# EAGLE design Bottlesumo-v2 (EAGLE 9.7.0)
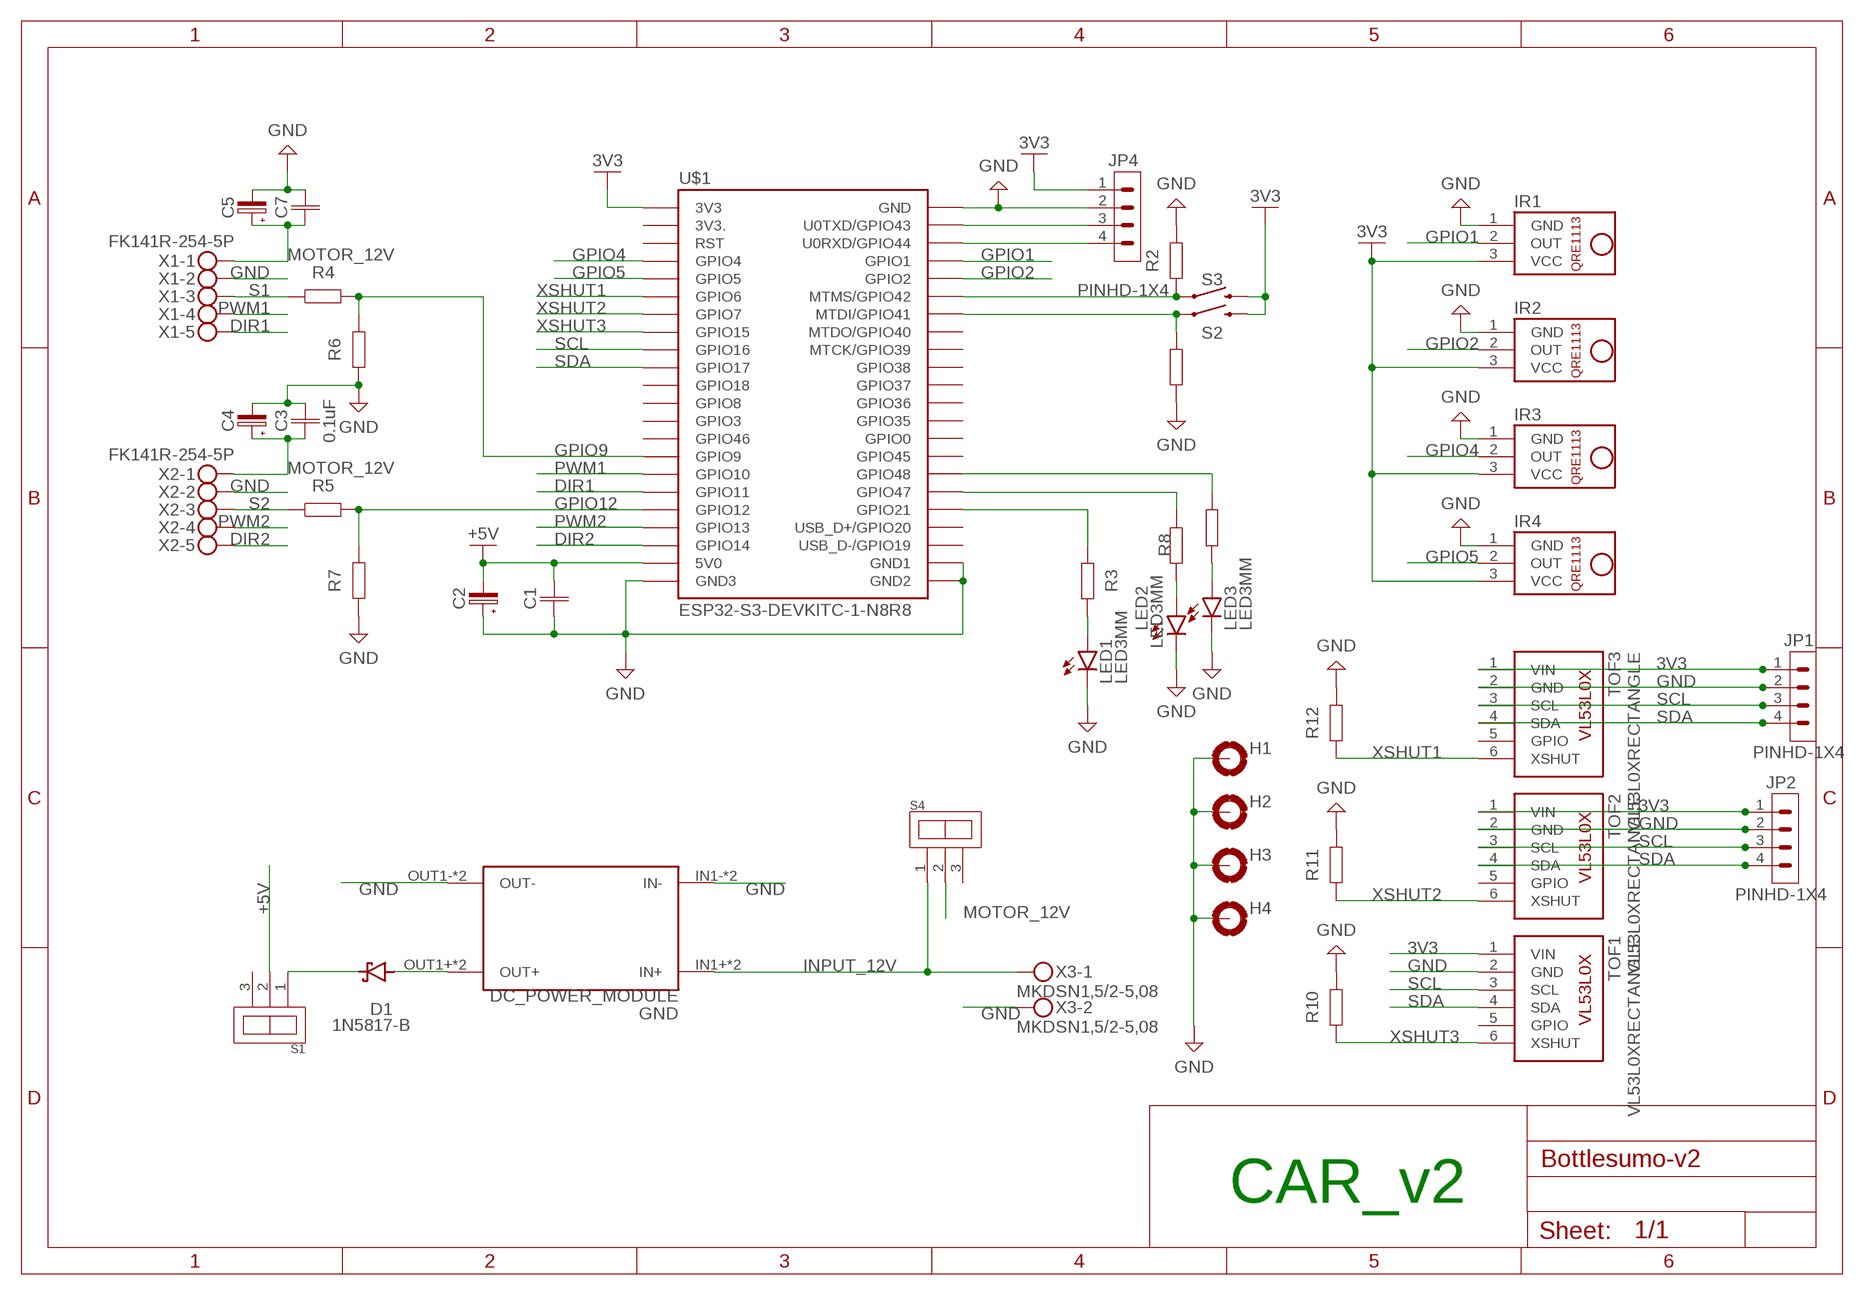
[diagram p0: schematic, sheet 1]

## Parts
C1  C_CHIP-1206(3216-METRIC)  [CAPC3216X135]
C2  C-POL_TANTALUM-1206(3216-METRIC)  [CAPMP3216X180N]
C3  0.1uF  C_CHIP-1206(3216-METRIC)  [CAPC3216X135]
C4  C-POL_TANTALUM-1206(3216-METRIC)  [CAPMP3216X180N]
C5  C-POL_TANTALUM-1206(3216-METRIC)  [CAPMP3216X180N]
C7  C_CHIP-1206(3216-METRIC)  [CAPC3216X135]
D1  1N5817-B  [DO41-7.6]
GND  DC_POWER_MODULE  [DC_POWER_MODULE]
H1  MOUNT-PAD-ROUND3.2  [3,2-PAD]
H2  MOUNT-PAD-ROUND3.2  [3,2-PAD]
H3  MOUNT-PAD-ROUND3.2  [3,2-PAD]
H4  MOUNT-PAD-ROUND3.2  [3,2-PAD]
IR1  QRE1113  [QRE1113]
IR2  QRE1113  [QRE1113]
IR3  QRE1113  [QRE1113]
IR4  QRE1113  [QRE1113]
JP1  PINHD-1X4  [1X04]
JP2  PINHD-1X4  [1X04]
JP4  PINHD-1X4  [1X04]
LED1  LED3MM  [LED3MM]
LED2  LED3MM  [LED3MM]
LED3  LED3MM  [LED3MM]
R1  R_CHIP-1206(3216-METRIC)  [RESC3216X70]
R2  R_CHIP-1206(3216-METRIC)  [RESC3216X70]
R3  R_CHIP-1206(3216-METRIC)  [RESC3216X70]
R4  R_CHIP-1206(3216-METRIC)  [RESC3216X70]
R5  R_CHIP-1206(3216-METRIC)  [RESC3216X70]
R6  R_CHIP-1206(3216-METRIC)  [RESC3216X70]
R7  R_CHIP-1206(3216-METRIC)  [RESC3216X70]
R8  R_CHIP-1206(3216-METRIC)  [RESC3216X70]
R9  R_CHIP-1206(3216-METRIC)  [RESC3216X70]
R10  R_CHIP-1206(3216-METRIC)  [RESC3216X70]
R11  R_CHIP-1206(3216-METRIC)  [RESC3216X70]
R12  R_CHIP-1206(3216-METRIC)  [RESC3216X70]
S1  SS12D10  SS12D10SS12D10_SS12D10  [SS12D10]
S2  MOMENTARY-SWITCH-SPST-PTH-12MM  [TACTILE_SWITCH_PTH_12MM]
S3  MOMENTARY-SWITCH-SPST-PTH-12MM  [TACTILE_SWITCH_PTH_12MM]
S4  SS12D10  SS12D10SS12D10_SS12D10  [SS12D10]
TOF1  VL53L0XRECTANGLE  [VL53L0X]
TOF2  VL53L0XRECTANGLE  [VL53L0X]
TOF3  VL53L0XRECTANGLE  [VL53L0X]
U$1  ESP32-S3-DEVKITC-1-N8R8  [ESP32-S3-DEVKITC-1-N8R8]
X1  FK141R-254-5P  [KF141R-254-5P]
X2  FK141R-254-5P  [KF141R-254-5P]
X3  MKDSN1,5/2-5,08  [MKDSN1,5/2-5,08]

## Nets
3V3: IR1.3(VCC) IR2.3(VCC) IR3.3(VCC) IR4.3(VCC) JP1.1 JP2.1 JP4.1 S2.3 S2.4 S3.3 S3.4 TOF1.1(VIN) TOF2.1(VIN) TOF3.1(VIN) U$1.J1_1(3V3)
+5V: C1.2 C2.2(-) S1.2(NULL) U$1.J1_21(5V0)
DIR1: U$1.J1_17(GPIO11) X1.P$9 X1.P$10
DIR2: U$1.J1_20(GPIO14) X2.P$9 X2.P$10
GND: C1.1 C2.1(+) C3.2 C4.2(-) C5.2(-) C7.2 GND.IN1-(IN-) GND.IN2-(IN-) GND.OUT1-(OUT-) GND.OUT2-(OUT-) H1.B3,2(MOUNT) H2.B3,2(MOUNT) H3.B3,2(MOUNT) H4.B3,2(MOUNT) IR1.1(GND) IR2.1(GND) IR3.1(GND) IR4.1(GND) JP1.2 JP2.2 JP4.2 LED1.K(C) LED2.K(C) LED3.K(C) R1.1 R2.2 R6.1 R7.1 R10.2 R11.2 R12.2 TOF1.2(GND) TOF2.2(GND) TOF3.2(GND) U$1.J1_22(GND3) U$1.J3_1(GND) U$1.J3_21(GND1) U$1.J3_22(GND2) X1.P$2 X1.P$6 X2.P$2 X2.P$6 X3.2
GPIO1: IR1.2(OUT) U$1.J3_4(GPIO1)
GPIO2: IR2.2(OUT) U$1.J3_5(GPIO2)
GPIO4: IR3.2(OUT) U$1.J1_4(GPIO4)
GPIO5: IR4.2(OUT) U$1.J1_5(GPIO5)
GPIO9: R4.2 R6.2 U$1.J1_15(GPIO9)
GPIO12: R5.2 R7.2 U$1.J1_18(GPIO12)
INPUT_12V: GND.IN1+(IN+) GND.IN2+(IN+) S4.1(NULL) X3.1
MOTOR_12V: C3.1 C4.1(+) C5.1(+) C7.1 S4.2(NULL) X1.P$1 X1.P$5 X2.P$1 X2.P$5
N$1: D1.A GND.OUT1+(OUT+) GND.OUT2+(OUT+)
N$2: D1.C S1.1(NULL)
N$3: R1.2 S2.1 S2.2 U$1.J3_7(MTDI/GPIO41)
N$4: R2.1 S3.1 S3.2 U$1.J3_6(MTMS/GPIO42)
N$5: R3.1 U$1.J3_18(GPIO21)
N$6: LED1.A R3.2
N$7: R8.1 U$1.J3_17(GPIO47)
N$8: LED2.A R8.2
N$9: R9.1 U$1.J3_16(GPIO48)
N$10: LED3.A R9.2
N$11: U$1.J3_19(USB_D+/GPIO20)
N$12: JP4.3 U$1.J3_2(U0TXD/GPIO43)
N$13: JP4.4 U$1.J3_3(U0RXD/GPIO44)
PWM1: U$1.J1_16(GPIO10) X1.P$4 X1.P$8
PWM2: U$1.J1_19(GPIO13) X2.P$4 X2.P$8
S1: R4.1 X1.P$3 X1.P$7
S2: R5.1 X2.P$3 X2.P$7
SCL: JP1.3 JP2.3 TOF1.3(SCL) TOF2.3(SCL) TOF3.3(SCL) U$1.J1_9(GPIO16)
SDA: JP1.4 JP2.4 TOF1.4(SDA) TOF2.4(SDA) TOF3.4(SDA) U$1.J1_10(GPIO17)
XSHUT1: R12.1 TOF3.6(XSHUT) U$1.J1_6(GPIO6)
XSHUT2: R11.1 TOF2.6(XSHUT) U$1.J1_7(GPIO7)
XSHUT3: R10.1 TOF1.6(XSHUT) U$1.J1_8(GPIO15)
Unconnected: S1.3(NULL) S4.3(NULL) TOF1.5(GPIO) TOF2.5(GPIO) TOF3.5(GPIO) U$1.J1_3(RST) U$1.J1_11(GPIO18) U$1.J1_12(GPIO8) U$1.J1_13(GPIO3) U$1.J1_14(GPIO46) U$1.J3_8(MTDO/GPIO40) U$1.J3_9(MTCK/GPIO39) U$1.J3_10(GPIO38) U$1.J3_11(GPIO37) U$1.J3_12(GPIO36) U$1.J3_13(GPIO35) U$1.J3_14(GPIO0) U$1.J3_15(GPIO45) U$1.J3_20(USB_D-/GPIO19)

## Notes on the sheet
- CAR_v2

## Power pins joined to a net without a drawn wire
3V3.: U$1.J1_2(3V3.)

## Library data of the parts
C1 C3 C7 = PAEN Components Library:C: Capacitor - Generic
C2 C4 C5 = PAEN Components Library:C-POL: Capacitor Polarised - Generic
D1 = PAEN Components Library:1N581*: 1.0A SCHOTTKY BARRIER RECTIFIER Source: http://www.diodes.com/datasheets/ds23001.pdf
GND = PAEN Components Library:DC_POWER_MODULE
H1-H4 = PAEN Components Library:MOUNT-PAD-ROUND: MOUNTING PAD, round
IR1-IR4 = PAEN Components Library:QRE1113
JP1 JP2 JP4 = PAEN Components Library:PINHD-1X4: Pin Header
LED1-LED3 = PAEN Components Library:LED
R1-R12 = PAEN Components Library:R: Resistor Fixed - Generic
S1 S4 = PAEN Components Library:SS12D10: Vertical Slide Switch 3 Pins 6.7x12.7x6.4mm.
S2 S3 = PAEN Components Library:MOMENTARY-SWITCH-SPST: Momentary Switch (Pushbutton) - SPST Normally-open (NO) SPST momentary switches (buttons, pushbuttons). Variants PTH-12MM - 12mm square, through-hole Momentary Pushbutton Switch - 12mm Square <https://www.sparkfun.com/products/9190> (COM-09190) PTH-6.0MM, PTH-6.0MM-KIT - 6.0mm square, through-hole Mini Pushbutton Switch <https://www.sparkfun.com/products/97> (COM-00097) KIT package intended for soldering kit's - only one side of pads' copper is exposed. PTH-RIGHT-ANGLE-KIT - Right-angle, through-hole Right Angle Tactile Button <https://www.sparkfun.com/products/10791> - Used on SparkFun BigTime Watch Kit <https://www.sparkfun.com/products/11734> SMD-12MM - 12mm square, surface-mount Tactile Button - SMD (12mm) <https://www.sparkfun.com/products/12993> (COM-12993) Used on SparkFun PicoBoard <https://www.sparkfun.com/products/11888> SMD-4.5MM - 4.5mm Square Trackball Switch Used on SparkFun Blackberry Trackballer Breakout <https://www.sparkfun.com/products/13169> SMD-4.6MMX2.8MM - 4.60mm x 2.80mm, surface mount Used on SparkFun SAMD21 Mini Breakout <https://www.sparkfun.com/products/13664> SMD-5.2MM, SMD-5.2-REDUNDANT - 5.2mm square, surface-mount Mini Pushbutton Switch - SMD <https://www.sparkfun.com/products/8720> (COM-08720) Used on Arduino Pro Mini <https://www.sparkfun.com/products/11114> REDUNDANT package connects both switch circuits together SMD-6.0X3.5MM - 6.0 x 3.5mm, surface mount Momentary Reset Switch SMD <https://www.sparkfun.com/products/8229> (COM-08229) SMD-6.2MM-TALL - 6.2mm square, surface mount Tactile Button - SMD (6mm) <https://www.sparkfun.com/products/12992> Used on SparkFun Digital Sandbox <https://www.sparkfun.com/products/12651> SMD-RIGHT-ANGLE - Right-angle, surface mount Used on SparkFun Block for Intel® Edison - Arduino <https://www.sparkfun.com/products/13036>
TOF1-TOF3 = PAEN Components Library:VL53L0X
U$1 = PAEN Components Library:ESP32-S3-DEVKITC-1-N8R8: Check availability <https://pricing.snapeda.com/parts/ESP32-S3-DEVKITC-1-N8R8/Espressif%20Systems/view-part?ref=eda>
X1 X2 = PAEN Components Library:FK141R-254-5P
X3 = PAEN Components Library:MKDSN1,5/2-5,08: MKDSN 1,5/ 2-5,08 Printklemme Nennstrom: 13,5 A Nennspannung: 250 V Rastermaß: 5,08 mm Polzahl: 2 Anschlussart: Schraubanschluss Montage: Löten Anschlussrichtung Leiter/Platine: 0 ° Artikelnummer: 1729128 Source: http://eshop.phoenixcontact.com .. 1729128.pdf

## Board
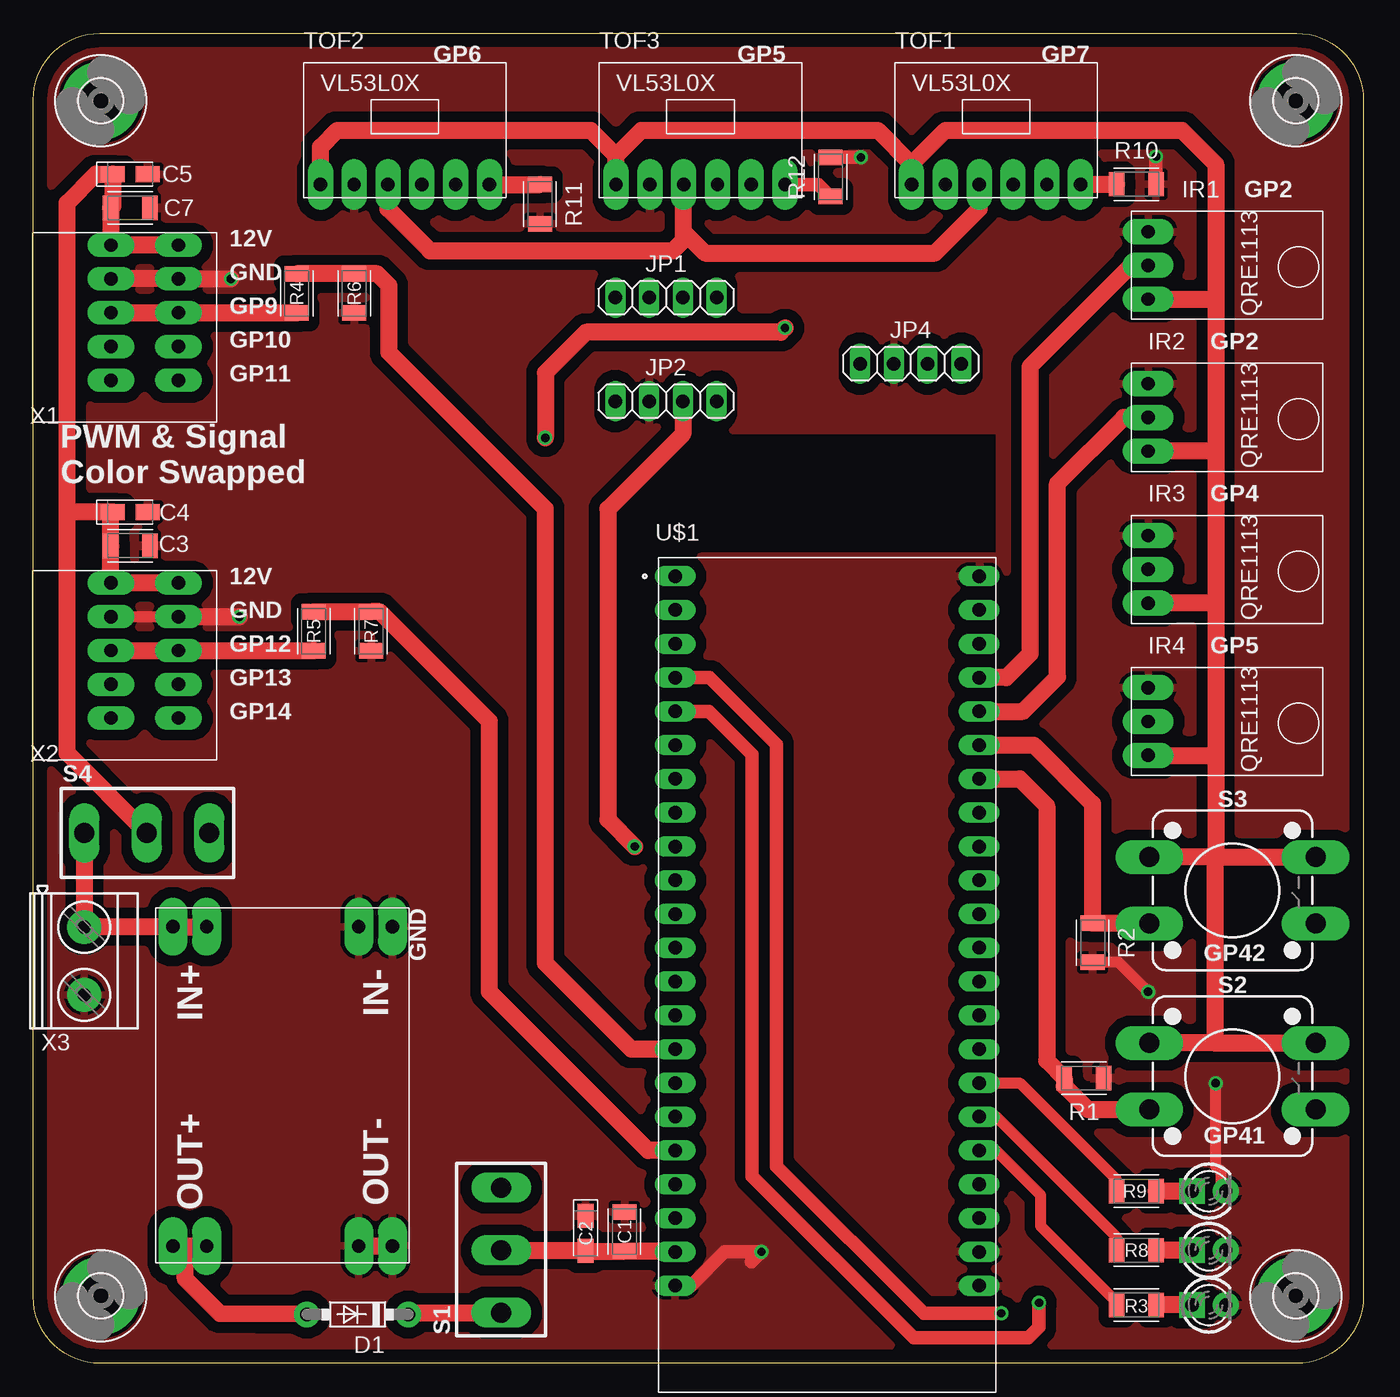
[diagram p1: board, top side]
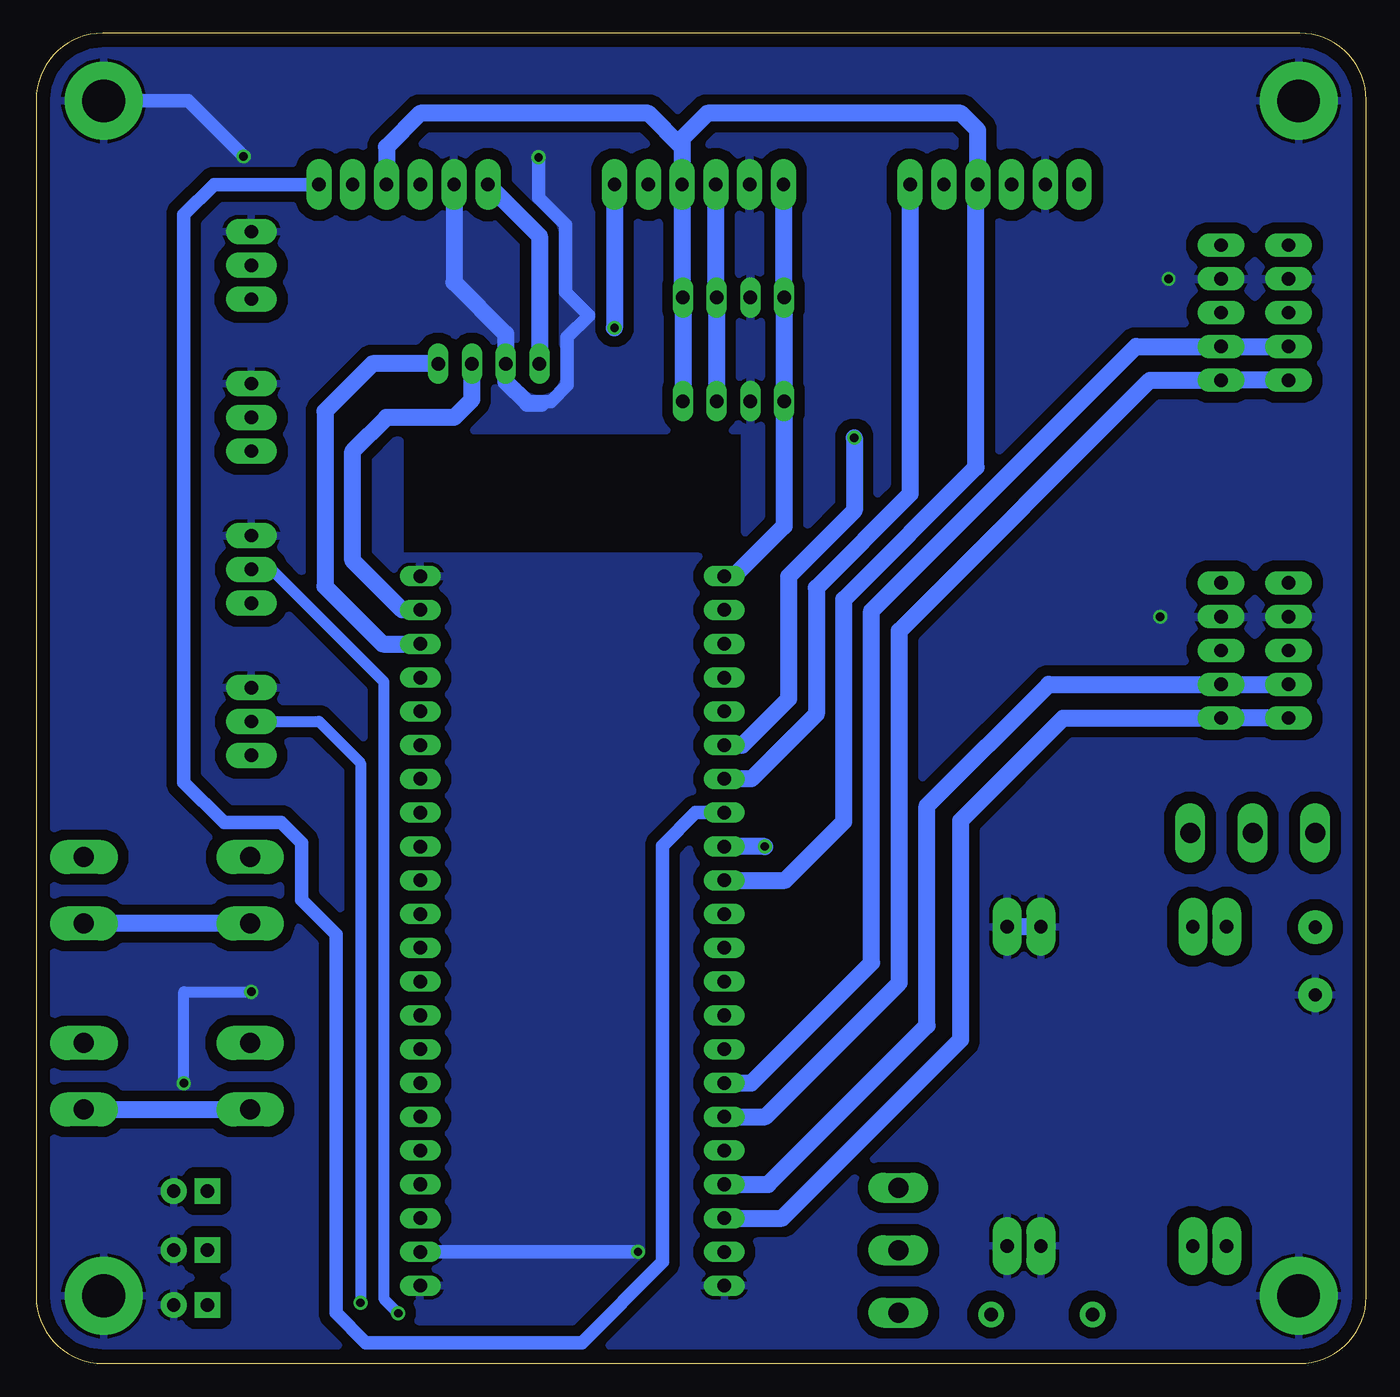
[diagram p2: board, bottom side, seen from below]

Size 100 x 100 mm. Coordinates in mm from the lower left corner, seen from the top.
Outline: 0,5 0,95 arc-90 5,100 95,100 arc-90 100,95 100,5 arc-90 95,0 5,0 arc-90 0,5
Copper layers (1*16): Top / Bottom
Stack-up Default Layer Stack: Top SilkScreen Epoxy Ink / Top SolderMask SR:Green 0.0254mm Dk 4.3 / Top Surface Finish Lead-Free 0.02mm / Top CuFoil:007 0.035mm / Dielectric-1 User Defined 1.5mm / Bottom CuFoil:007 0.035mm / Bottom Surface Finish Lead-Free 0.02mm / Bottom SolderMask SR:Green 0.0254mm Dk 4.3 / Bottom SilkScreen Epoxy Ink
Design rules: minimum drill size 25mil, minimum copper width 16mil, keepout clearance 0mil, drill distance 32mil, via restrict clearance 0mil, dimension clearance 40mil, restrict clearance 0mil, copper clearance wire_polygon to wire_polygon 16mil, copper clearance wire_polygon to pad_smd 16mil, copper clearance wire_polygon to via 16mil, copper clearance pad_smd to pad_smd 16mil, copper clearance pad_smd to via 16mil, copper clearance via to via 16mil, copper clearance smd to pad (same net) 16mil, copper clearance smd to via (same net) 16mil, copper clearance smd to smd (same net) 16mil

### Footprints (pad centres in the part's own frame; a part is rotated, then mirrored left to right if it is on the bottom)
CAPC3216X135 = smd 1.165 x 1.815: 1 -1.475,0; 2 1.475,0
CAPMP3216X180N = smd 1.796 x 1.189: 1 -1.31,0; 2 1.31,0
DO41-7.6 = drill 1 pad 1.93: A 3.81,0; C -3.81,0
DC_POWER_MODULE = drill 1 pad 2.184 long: IN1+ -24,-13.97; IN1- -24,0; IN2+ -24,-16.51; IN2- -24,-2.54; OUT1+ 0,-13.97; OUT1- 0,0; OUT2+ 0,-16.51; OUT2- 0,-2.54
3,2-PAD = drill 3.2 pad 5.842: B3,2 0,0
QRE1113 = drill 1 pad 1.93 long: 1 0,2.54; 2 0,0; 3 0,-2.54
1X04 = drill 1.016 long: 1 -3.81,0; 2 -1.27,0; 3 1.27,0; 4 3.81,0
LED3MM = drill 1 pad 1.93 square: A -1.27,0 | drill 1 pad 1.93: K 1.27,0
RESC3216X70 = smd 1.165 x 1.815: 1 -1.475,0; 2 1.475,0
SS12D10 = drill 1.5 pad 2 long: 1 -4.7,0; 2 0,0; 3 4.7,0
TACTILE_SWITCH_PTH_12MM = drill 1.5 pad 2.54 long: 1 6.25,-2.5; 2 -6.25,-2.5; 3 6.25,2.5; 4 -6.25,2.5
VL53L0X = drill 1 pad 1.93 long: 1 -6.35,-0.267; 2 -3.81,-0.267; 3 -1.27,-0.267; 4 1.27,-0.267; 5 3.81,-0.267; 6 6.35,-0.267
ESP32-S3-DEVKITC-1-N8R8 = drill 1.02 long: J1_1 -11.43,29.97; J1_2 -11.43,27.43; J1_3 -11.43,24.89; J1_4 -11.43,22.35; J1_5 -11.43,19.81; J1_6 -11.43,17.27; J1_7 -11.43,14.73; J1_8 -11.43,12.19; J1_9 -11.43,9.65; J1_10 -11.43,7.11; J1_11 -11.43,4.57; J1_12 -11.43,2.03; J1_13 -11.43,-0.51; J1_14 -11.43,-3.05; J1_15 -11.43,-5.59; J1_16 -11.43,-8.13; J1_17 -11.43,-10.67; J1_18 -11.43,-13.21; J1_19 -11.43,-15.75; J1_20 -11.43,-18.29; J1_21 -11.43,-20.83; J1_22 -11.43,-23.37; J3_1 11.43,29.97; J3_2 11.43,27.43; J3_3 11.43,24.89; J3_4 11.43,22.35; J3_5 11.43,19.81; J3_6 11.43,17.27; J3_7 11.43,14.73; J3_8 11.43,12.19; J3_9 11.43,9.65; J3_10 11.43,7.11; J3_11 11.43,4.57; J3_12 11.43,2.03; J3_13 11.43,-0.51; J3_14 11.43,-3.05; J3_15 11.43,-5.59; J3_16 11.43,-8.13; J3_17 11.43,-10.67; J3_18 11.43,-13.21; J3_19 11.43,-15.75; J3_20 11.43,-18.29; J3_21 11.43,-20.83; J3_22 11.43,-23.37
KF141R-254-5P = drill 1 pad 1.778 long: P$1 0,0; P$2 2.54,0; P$3 5.08,0; P$4 7.62,0; P$5 0,-5.08; P$6 2.54,-5.08; P$7 5.08,-5.08; P$8 7.62,-5.08; P$9 10.16,0; P$10 10.16,-5.08
MKDSN1,5/2-5,08 = drill 1 pad 2.54: 1 -2.561,0.025; 2 2.519,0.025

### Placement (x,y rotation side)
C1  44.45,9.91 270 top
C2  41.53,9.78 270 top
C3  7.29,61.47 0 top
C4  7.29,64.01 0 top
C5  7.29,89.41 0 top
C7  7.29,86.87 0 top
D1  24.38,3.68 180 top
GND  27,8.83 270 top
H1  94.92,5.08 0 top
H2  5.08,5.08 0 top
H3  94.92,94.92 0 top
H4  5.08,94.92 0 top
IR1  83.82,82.55 0 top
IR2  83.82,71.12 0 top
IR3  83.82,59.69 0 top
IR4  83.82,48.26 0 top
JP1  47.57,80.13 0 top
JP2  47.57,72.34 0 top
JP4  65.96,75.15 0 top
LED1  88.39,4.39 0 top
LED2  88.39,8.51 0 top
LED3  88.39,12.95 0 top
R1  78.99,21.45 180 top
R2  79.65,31.62 270 top
R3  82.93,4.39 0 top
R4  19.81,80.44 90 top
R5  21.08,55.04 90 top
R6  24.13,80.44 90 top
R7  25.4,55.04 90 top
R8  82.93,8.51 0 top
R9  82.93,12.95 0 top
R10  82.93,88.65 0 top
R11  38.1,87.15 270 top
R12  59.94,89.2 90 top
S1  35.18,8.51 90 top
S2  90.16,21.59 0 top
S3  90.16,35.56 0 top
S4  8.54,39.88 0 top
TOF1  72.39,88.9 0 top
TOF2  27.94,88.9 0 top
TOF3  50.17,88.9 0 top
U$1  59.69,29.21 0 top
X1  10.92,84.07 270 top
X2  10.92,58.67 270 top
X3  3.81,30.23 270 top

### Tracks (layer width: path | path; a pad name or v marks a point on that pad's centre or on a via)
3V3
  Top 1.27: TOF2.1 21.59,91.44 22.86,92.71 41.91,92.71 43.81,90.8 | TOF3.1 43.81,90.8 | 43.81,90.8 45.72,92.71 63.5,92.71 66.04,90.17 | 66.04,90.17 TOF1.1 | 66.04,90.17 68.58,92.71 86.36,92.71 88.9,90.17 88.9,80.01 | 88.9,80.01 88.9,68.58 | 88.9,68.58 88.9,57.15 | 88.9,57.15 88.9,45.72 | 88.9,45.72 88.9,38.1 88.86,38.06 | 88.86,24.09 88.86,38.06 | IR1.3 88.9,80.01 | 88.9,68.58 IR2.3 | 88.9,57.15 IR3.3 | IR4.3 88.9,45.72 | 88.86,24.09 S2.3 | 88.86,24.09 S2.4 | 88.86,38.06 S3.3 | 88.86,38.06 S3.4
  Bottom 1.27: TOF1.1 62.15,84.75 JP4.1 | TOF3.1 43.81,80.18 JP1.1 JP2.1 43.76,62.94 43.76,62.93 47.52,59.18 U$1.J1_1
+5V
  Top 1.27: S1.2 41.49,8.51 C2.2 41.57,8.43 C1.2 48.21,8.43 U$1.J1_21
DIR1
  Bottom 1.27: U$1.J1_17 45.18,18.54 35.1,28.62 35.1,55.07 16.26,73.91 X1.P$9 X1.P$10
DIR2
  Bottom 1.27: U$1.J1_20 43.91,10.92 30.48,24.35 30.48,40.81 22.78,48.51 X2.P$9 X2.P$10
GND  (via drill 0.64)
  Top 0.813: X2.P$6 X2.P$2 | LED3.K 89.31,13.31 89.31,14.42 88.9,14.83 v88.9,21.06 | R2.2 81.61,30.15 v83.82,27.94
  Top 1.016: R12.2 v62.23,90.68 | R10.2 v84.41,90.74 | 53.98,7.62 v54.75,8.39 51.98,8.39 49.44,5.84 U$1.J1_22
  Top 1.27: GND.OUT2- GND.OUT1- | X1.P$6 X1.P$2 v14.86,81.53 | X2.P$2 v15.49,56.13
  Bottom 0.813: v88.9,21.06 88.9,27.94 v83.82,27.94
  Bottom 1.016: JP4.2 64.69,73.99 63.02,72.31 61.29,72.31 60.07,73.53 60.07,77.14 58.47,78.74 58.47,78.79 60.2,80.52 60.2,85.6 62.23,87.63 v62.23,90.68 | v84.41,90.74 88.59,94.92 H3.B3,2 | U$1.J3_21 v54.76,8.38 v54.75,8.39
  Bottom 1.27: 46.3,88.58 TOF3.2 | GND.IN2- GND.IN1- | TOF1.2 68.58,81.28 64.69,77.39 JP4.2 64.69,73.81 63.07,72.18 62.02,72.18
  pour Top (isolate 0.152): 100.33,100.33 -2.54,100.33 -2.54,0 100.33,0
  pour Bottom (isolate 0.152): -1.27,0 -1.27,99.06 100.33,99.06 100.33,0
GPIO1
  Top 1.27: U$1.J3_4 73.15,51.56 74.93,53.34 74.93,74.93 82.55,82.55 IR1.2
GPIO2
  Top 1.27: U$1.J3_5 74.42,49.02 77.01,51.61 77.01,66.15 81.98,71.12 IR2.2
GPIO4  (via drill 0.64)
  Top 1.016: v72.78,3.77 72.77,3.75 66.95,3.75 55.88,14.83 55.88,46.53 50.85,51.56 U$1.J1_4
  Bottom 0.813: v72.78,3.77 73.87,4.86 73.87,51.25 82.31,59.69 IR3.2
GPIO5  (via drill 0.64)
  Top 1.016: v75.61,4.55 75.61,2.71 74.82,1.92 66.19,1.92 54.05,14.07 54.05,45.77 50.8,49.02 U$1.J1_5
  Bottom 0.813: IR4.2 78.74,48.26 75.61,45.13 v75.61,4.55
GPIO9
  Top 1.27: R4.2 R6.2 25.86,81.92 26.74,81.04 26.74,76 38.51,64.24 38.51,30.07 44.96,23.62 U$1.J1_15
GPIO12
  Top 1.27: R5.2 R7.2 26.03,56.52 34.29,48.26 34.29,27.94 46.23,16 U$1.J1_18
INPUT_12V
  Top 1.27: GND.IN1+ GND.IN2+ 3.84,32.83 | S4.1 3.84,32.83 | X3.1 3.84,32.83
MOTOR_12V
  Top 1.27: S4.2 2.54,45.88 2.54,63.84 | 2.54,63.84 2.71,64.01 C4.1 5.81,63.68 C3.1 5.84,61.44 X2.P$5 X2.P$1 | 2.54,63.84 2.54,87.24 4.71,89.41 C5.1 5.98,87.03 C7.1 5.84,86.84 X1.P$5 X1.P$1
N$1
  Top 1.27: GND.OUT2+ 11.43,8.83 | 11.43,8.83 GND.OUT1+ | D1.A 14.05,3.73 11.43,6.35 11.43,8.83
N$2
  Top 1.27: D1.C 28.32,3.81 S1.1
N$3
  Top 1.27: U$1.J3_7 74.17,43.94 76.2,41.91 76.2,22.76 R1.2 77.52,20.86 79.29,19.09 S2.2
  Bottom 1.27: S2.1 S2.2
N$4
  Top 1.27: U$1.J3_6 75.22,46.48 79.63,42.07 79.63,33.11 R2.1 83.87,33.1 S3.2
  Bottom 1.27: S3.2 S3.1
N$5
  Top 0.813: U$1.J3_18 72.38,16 75.74,12.64 75.74,10.31 81.46,4.6 R3.1
N$6
  Top 1.27: LED1.A R3.2
N$7
  Top 0.813: R8.1 81.46,9.48 72.39,18.54 U$1.J3_17
N$8
  Top 1.27: LED2.A R8.2
N$9
  Top 0.813: U$1.J3_16 74.17,21.08 81.46,13.79 R9.1
N$10
  Top 1.27: R9.2 LED3.A
N$12
  Bottom 1.27: JP4.3 67.23,72.47 68.58,71.12 73.66,71.12 76.2,68.58 76.2,60.37 72.47,56.64 U$1.J3_2
N$13
  Bottom 1.27: JP4.4 74.71,75.15 78.28,71.58 78.28,58.42 73.96,54.1 U$1.J3_3
PWM1
  Bottom 1.27: U$1.J1_16 46.23,21.08 37.19,30.12 37.19,56.58 17.31,76.45 X1.P$4 X1.P$8
PWM2
  Bottom 1.27: U$1.J1_19 44.96,13.46 33.02,25.4 33.02,41.91 23.88,51.05 X2.P$4 X2.P$8
S1
  Top 1.27: X1.P$7 X1.P$3 19.78,78.99 R4.1
S2
  Top 1.27: X2.P$7 X2.P$3 21.05,53.59 R5.1
SCL  (via drill 0.64)
  Top 1.27: 48.9,85.09 48.9,84.45 48.08,83.64 29.82,83.64 26.67,86.8 TOF2.3 | 48.9,85.09 TOF3.3 | v45.21,38.86 43.2,40.88 43.2,64.23 48.84,69.88 JP2.3 | TOF1.3 71.12,86.8 67.81,83.48 50.5,83.48 48.9,85.09
  Bottom 1.27: U$1.J1_9 v45.21,38.86 | TOF3.3 48.9,80.13 JP1.3 JP2.3
SDA
  Bottom 1.27: 51.44,91.44 51.44,92.08 49.53,93.98 30.48,93.98 29.21,92.71 TOF2.4 29.34,88.51 29.34,67.37 39.27,57.44 39.27,40.74 43.69,36.32 U$1.J1_10 | 51.44,91.44 TOF3.4 51.44,80.18 JP1.4 JP2.4 | 51.44,91.44 53.97,93.98 71.12,93.98 73.66,91.44 TOF1.4
XSHUT1  (via drill 0.64)
  Top 1.016: TOF3.6 59.04,88.63 R12.1
  Top 1.27: v56.52,77.85 56.19,77.52 41.56,77.52 38.51,74.47 38.51,69.62 v38.48,69.6
  Bottom 1.27: TOF3.6 v56.52,77.85 | U$1.J1_6 46.91,46.48 43.43,49.95 43.43,59.17 38.48,64.12 v38.48,69.6
XSHUT2
  Top 1.27: TOF2.6 38.1,88.63 R11.1
  Bottom 1.27: U$1.J1_7 46.23,43.94 41.35,48.82 41.35,58.3 34.29,65.36 TOF2.6
XSHUT3
  Top 1.27: R10.1 81.44,88.63 TOF1.6
  Bottom 1.016: U$1.J1_8 50.42,41.4 52.91,38.91 52.91,7.62 58.97,1.56 75.22,1.56 77.45,3.79 77.45,32.24 80.05,34.83 80.05,39.13 81.56,40.65 85.86,40.65 88.9,43.69 88.9,86.36 86.63,88.63 TOF1.6
(copper drawn outside any net)
  shapes: Bottom area x1, Top area x1

### Text on the board
SilkscreenTop: GP6 | GP5 | GP7 | GP2 | 12V | GND | GP9 | GP10 | GP2 | GP11 | PWM & Signal / Color Swapped | GP4 | 12V | GND | GP12 | GP5 | GP13 | GP14 | GP42 | GP41